# Altium schematic sheet Sheet1.SchDoc
size A3
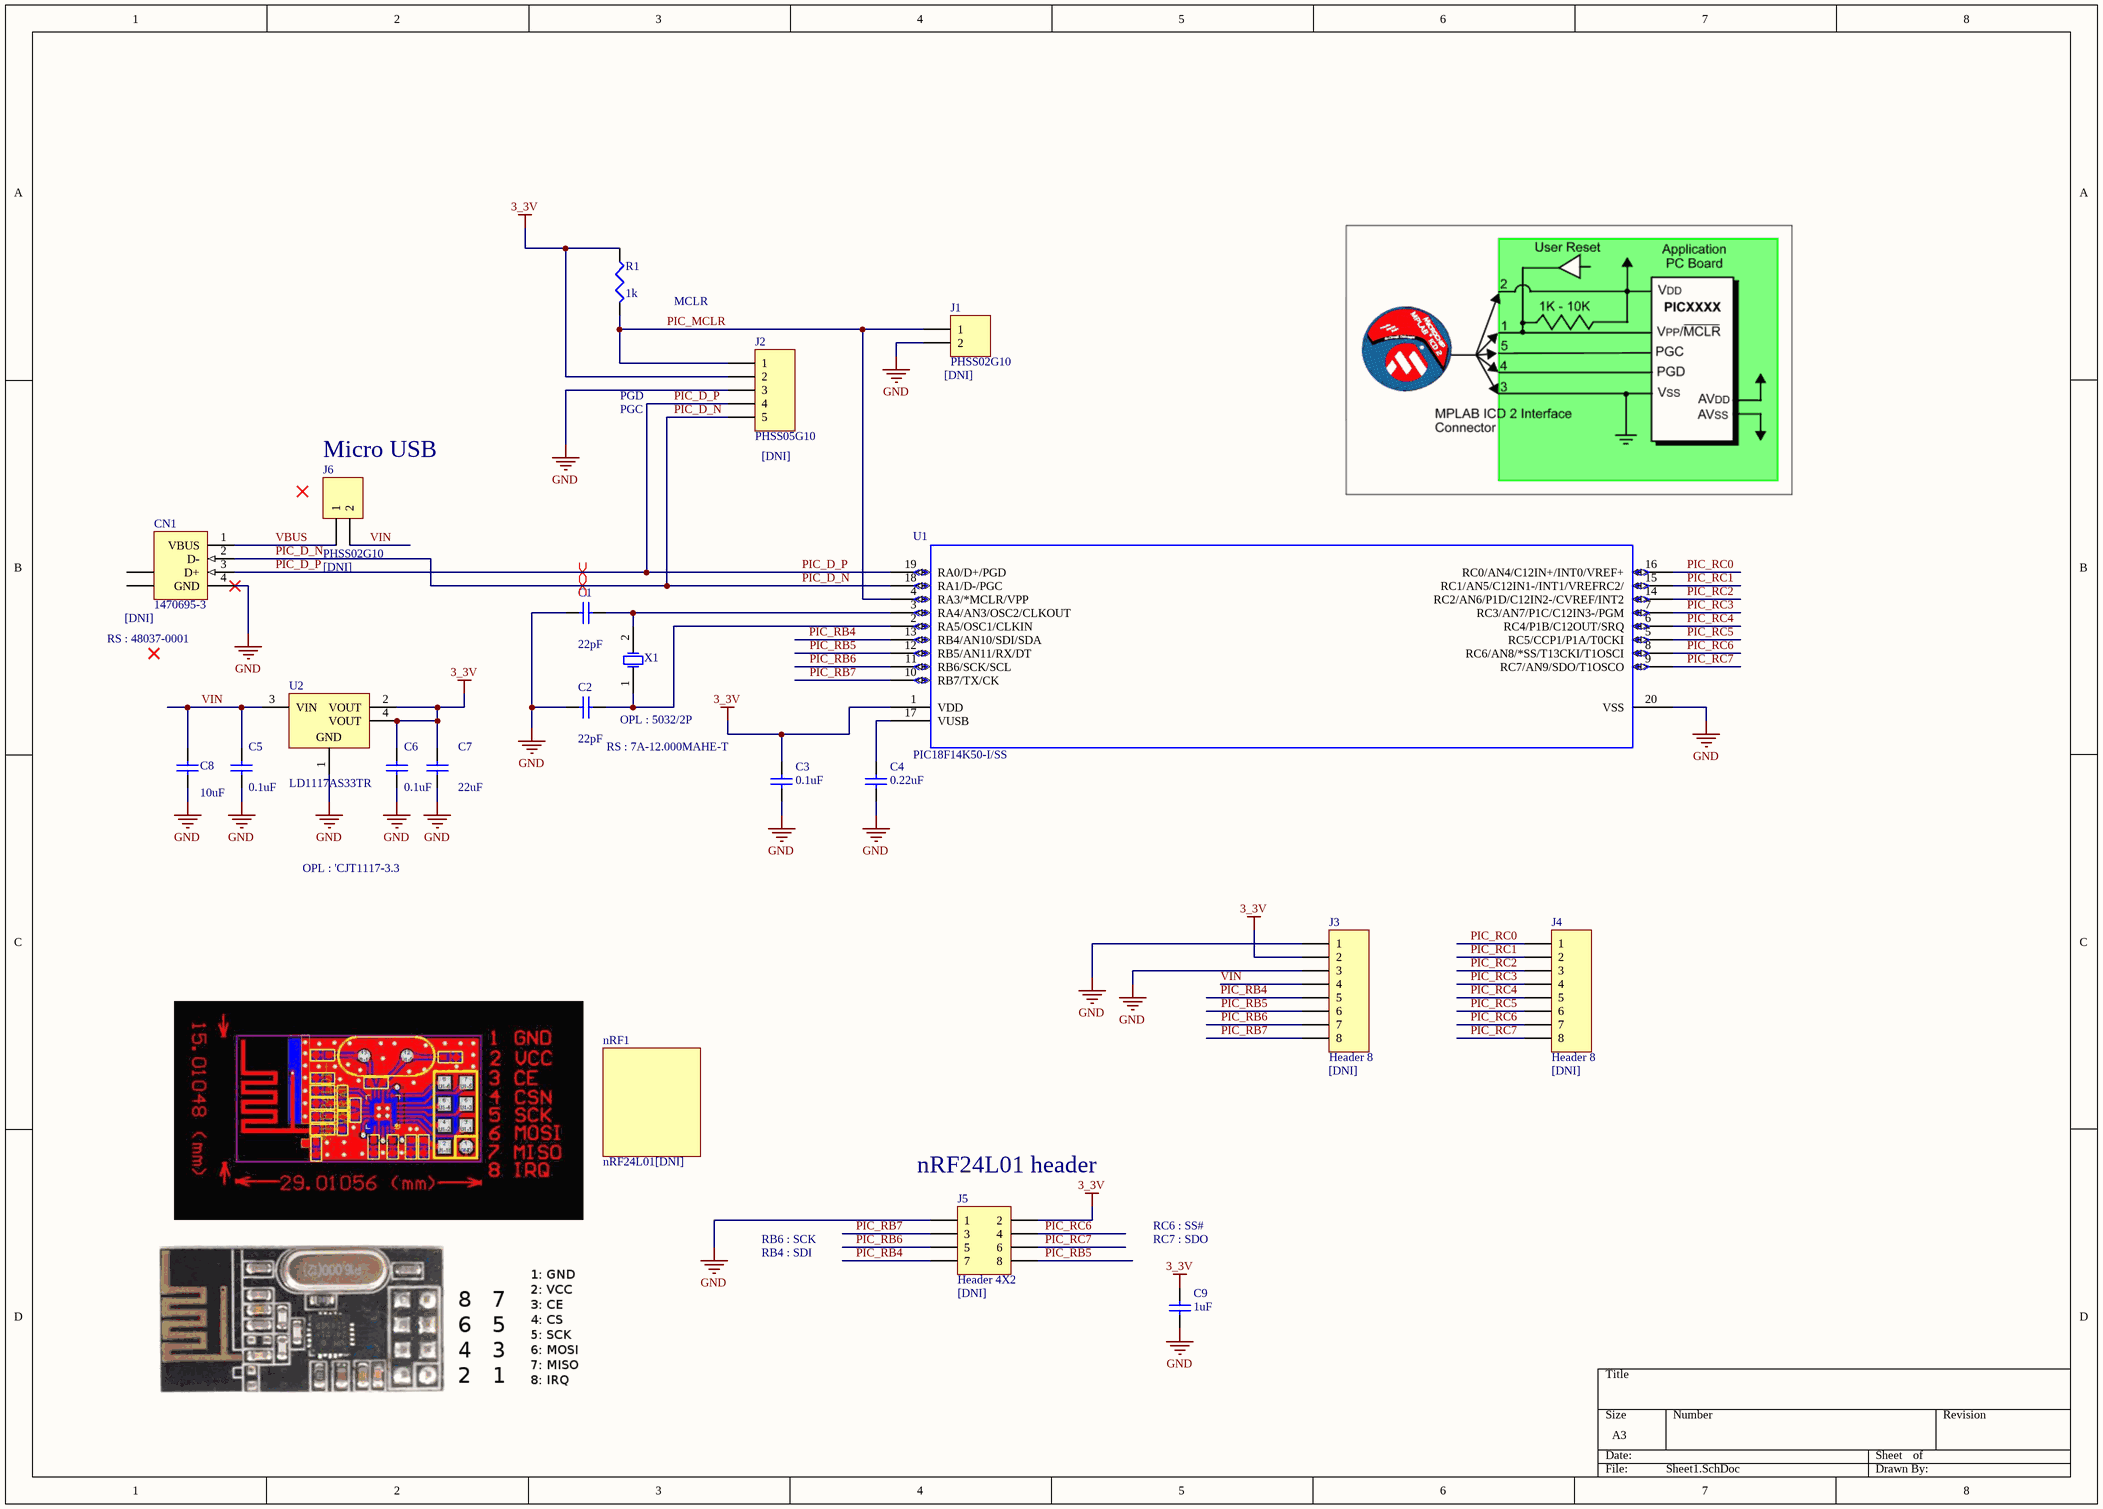
[diagram p0: Sheet1.SchDoc]

## Parts
C1  value 22pF  [CHIP1608]  (hidden comment: CC0603KRX7R9BB223)
C2  value 22pF  [CHIP1608]  (hidden comment: CC0603KRX7R9BB223)
C3  value 0.1uF  [CHIP1608]  (hidden comment: CC0603KRX7R9BB104)
C4  value 0.22uF  [CHIP1608]  (hidden comment: CC0603KRX7R8BB224)
C5  value 0.1uF  [CHIP1608]  (hidden comment: CC0603KRX7R9BB104)
C6  value 0.1uF  [CHIP1608]  (hidden comment: CC0603KRX7R9BB104)
C7  value 22uF  [CHIP3216]  (hidden comment: TAJA226K010RNJ)
C8  value 10uF  [CHIP3216]  (hidden comment: CC1206KKX5R8BB106)
C9  value 1uF  [CHIP1608]  (hidden comment: CC0603KRX7R8BB105)
CN1  1470695-3  assembly: [DNI]  [UP2-AH-1-TH]
J1  PHSS02G10  assembly: [DNI]  [HDR1X2]
J2  PHSS05G10  assembly: [DNI]  [HDR1X5]
J3  Header 8  assembly: [DNI]  [HDR1X8]
J4  Header 8  assembly: [DNI]  [HDR1X8]
J5  Header 4X2  assembly: [DNI]  [HDR2X4]
J6  PHSS02G10  assembly: [DNI]  [HDR1X2]
nRF1  nRF24L01[DNI]  [nRF24L01]
R1  value 1k  [CHIP1608]  (hidden comment: RC0603JR-071KL)
U1  PIC18F14K50-I/SS  [PIC18F14K50-SS]
U2  LD1117AS33TR  [SOT-223_N]
X1  445C33C12M00000  [445C33C12M00000]  (value not drawn)

## Nets
3_3V: C3.2 C6.2 C7.2 C9.2 J2.2 J3.2 J5.2 R1.1 U1.1(VDD) U2.2(VOUT) U2.4(VOUT)
GND: C1.1 C2.1 C3.1 C4.1 C5.1 C6.1 C7.1 C8.1 C9.1 CN1.4(GND) J1.2 J2.3 J3.1 J3.3 J5.1 U1.20(VSS) U2.1(GND)
PIC_D_N: CN1.2(D-) J2.5 U1.18(RA1/D-/PGC)
PIC_D_P: CN1.3(D+) J2.4 U1.19(RA0/D+/PGD)
PIC_MCLR: J1.1 J2.1 R1.2 U1.4(RA3/*MCLR/VPP)
PIC_RB4: J3.5 J5.7 U1.13(RB4/AN10/SDI/SDA)
PIC_RB5: J3.6 J5.8 U1.12(RB5/AN11/RX/DT)
PIC_RB6: J3.7 J5.5 U1.11(RB6/SCK/SCL)
PIC_RB7: J3.8 J5.3 U1.10(RB7/TX/CK)
PIC_RC0: J4.1 U1.16(RC0/AN4/C12IN+/INT0/VREF+)
PIC_RC1: J4.2 U1.15(RC1/AN5/C12IN1-/INT1/VREFRC2/)
PIC_RC2: J4.3 U1.14(RC2/AN6/P1D/C12IN2-/CVREF/INT2)
PIC_RC3: J4.4 U1.7(RC3/AN7/P1C/C12IN3-/PGM)
PIC_RC4: J4.5 U1.6(RC4/P1B/C12OUT/SRQ)
PIC_RC5: J4.6 U1.5(RC5/CCP1/P1A/T0CKI)
PIC_RC6: J4.7 J5.4 U1.8(RC6/AN8/*SS/T13CKI/T1OSCI)
PIC_RC7: J4.8 J5.6 U1.9(RC7/AN9/SDO/T1OSCO)
VBUS: CN1.1(VBUS) J6.1
VIN: C5.2 C8.2 J3.4 J6.2 U2.3(VIN)
NetC1_2: C1.2 U1.3(RA4/AN3/OSC2/CLKOUT) X1.2(OSC2)
NetC2_2: C2.2 U1.2(RA5/OSC1/CLKIN) X1.1(OSC1)
NetC4_2: C4.2 U1.17(VUSB)

Not connected (* = marked no-connect by the designer): CN1 5(SHLD) 6(SHLD)

## Layout directives
differential pair: PIC_D_N, PIC_D_P

## Notes on the sheet
- MCLR
- PGD
- PGC
- Micro USB
- (near CN1) RS : 48037-0001
- (near C2) OPL : 5032/2P
- RS : 7A-12.000MAHE-T
- OPL : 'CJT1117-3.3
- (near J5) nRF24L01 header
- RB4 : SDI
- RB6 : SCK
- RC6 : SS#
- RC7 : SDO

## Library data of the parts
C1-C3 = Cap Semi: Capacitor (Semiconductor SIM Model); Published: 8-Jun-2000; LatestRevisionDate: 17-Jul-2002; LatestRevisionNote: Re-released for DXP Platform.; PackageReference: C1206; Publisher: Altium Limited
C4-C9 = Cap Semi: Capacitor (Semiconductor SIM Model); Vendor: element14(GTI); Published: 8-Jun-2000; LatestRevisionDate: 17-Jul-2002; LatestRevisionNote: Re-released for DXP Platform.; PackageReference: C1206; Publisher: Altium Limited
  C6: part2: CC0603KRX7R9BB104
  C7 C8: part2: CC1206KKX5R8BB226
CN1 = 1470695-3: USB 1.1, Right Angle, SMT, A Type, Plug, 4 Position, Black; ContactMaterial: Brass; ContactPlating: Gold (30) over Nickel (50); PCB_Layout: Complies with manufacturer's recommendation.; DrillSize: Corresponds to nominal value.; PanelGround: Without; Published: 15-Jul-2004; DatasheetDocument: 21-Jan-2003; PackageDocument: 21-Jan-2003; PackageReference: 1470695; Publisher: Altium Limited; HousingMaterial: Thermoplastic; ComponentLink1Description: Manufacturer Link; ComponentLink1URL: http://www.tycoelectronics.com/; ComponentLink2Description: Packaging Specification; ComponentLink2URL: http://ecommas.tycoelectronics.com/commerce/DocumentDelivery/DDEController?Action=showdoc&DocId=Customer+Drawing%7F1470695%7FO%7Fpdf%7FEnglish%7FC_1470695_O.pdf
J1 J6 = Header 2: Header, 2-Pin; Vendor: ES; LatestRevisionDate: 17-Jul-2002; LatestRevisionNote: Re-released for DXP Platform.; Publisher: Altium Limited
J2 = Header 5: Header, 5-Pin; Vendor: ES; LatestRevisionDate: 17-Jul-2002; LatestRevisionNote: Re-released for DXP Platform.; Publisher: Altium Limited
J3 J4 = Header 8: Header, 8-Pin; LatestRevisionDate: 17-Jul-2002; LatestRevisionNote: Re-released for DXP Platform.; Publisher: Altium Limited
J5 = Header 4X2: Header, 4-Pin, Dual row; LatestRevisionDate: 17-Jul-2002; LatestRevisionNote: Re-released for DXP Platform.; Publisher: Altium Limited
nRF1 = nRF24L01
R1 = Res3: Resistor; Published: 8-Jun-2000; LatestRevisionDate: 04-Mar-2005; LatestRevisionNote: PCB Footprint replaced.; PackageReference: J1-0603; Publisher: Altium Limited
U1 = PIC18F14K50: MICROCHIPS; Vendor: ES
U2 = LD1117AS33TR: 1A, Low Drop Positive Voltage Regulator, 3.3V, 4-Pin SOT-223, Tape and Reel; Vendor: ES; DatasheetVersion: Dec-2011; PackageVersion: 2010; PackageReference: SOT-223; PackageDescription: 4-Pin SOT-223 Package, 6.5 x 3.5 mm Body, 2.3 mm Pitch, 7 mm Lead Span; PartNumber: LD1117AS33TR; ComponentLink1Description: Manufacturer URL; ComponentLink1URL: http://www.st.com; ComponentLink2Description: Datasheet; ComponentLink2URL: http://www.st.com/internet/com/TECHNICAL_RESOURCES/TECHNICAL_LITERATURE/DATASHEET/CD00002116.pdf; part2: LD1117AS33TR
X1 = ABLS-25.000MHZ-B2F-T: MEC; Vendor: ES